# EAGLE schematic EncoderPCB_V1_0 (EAGLE 9.5.1)
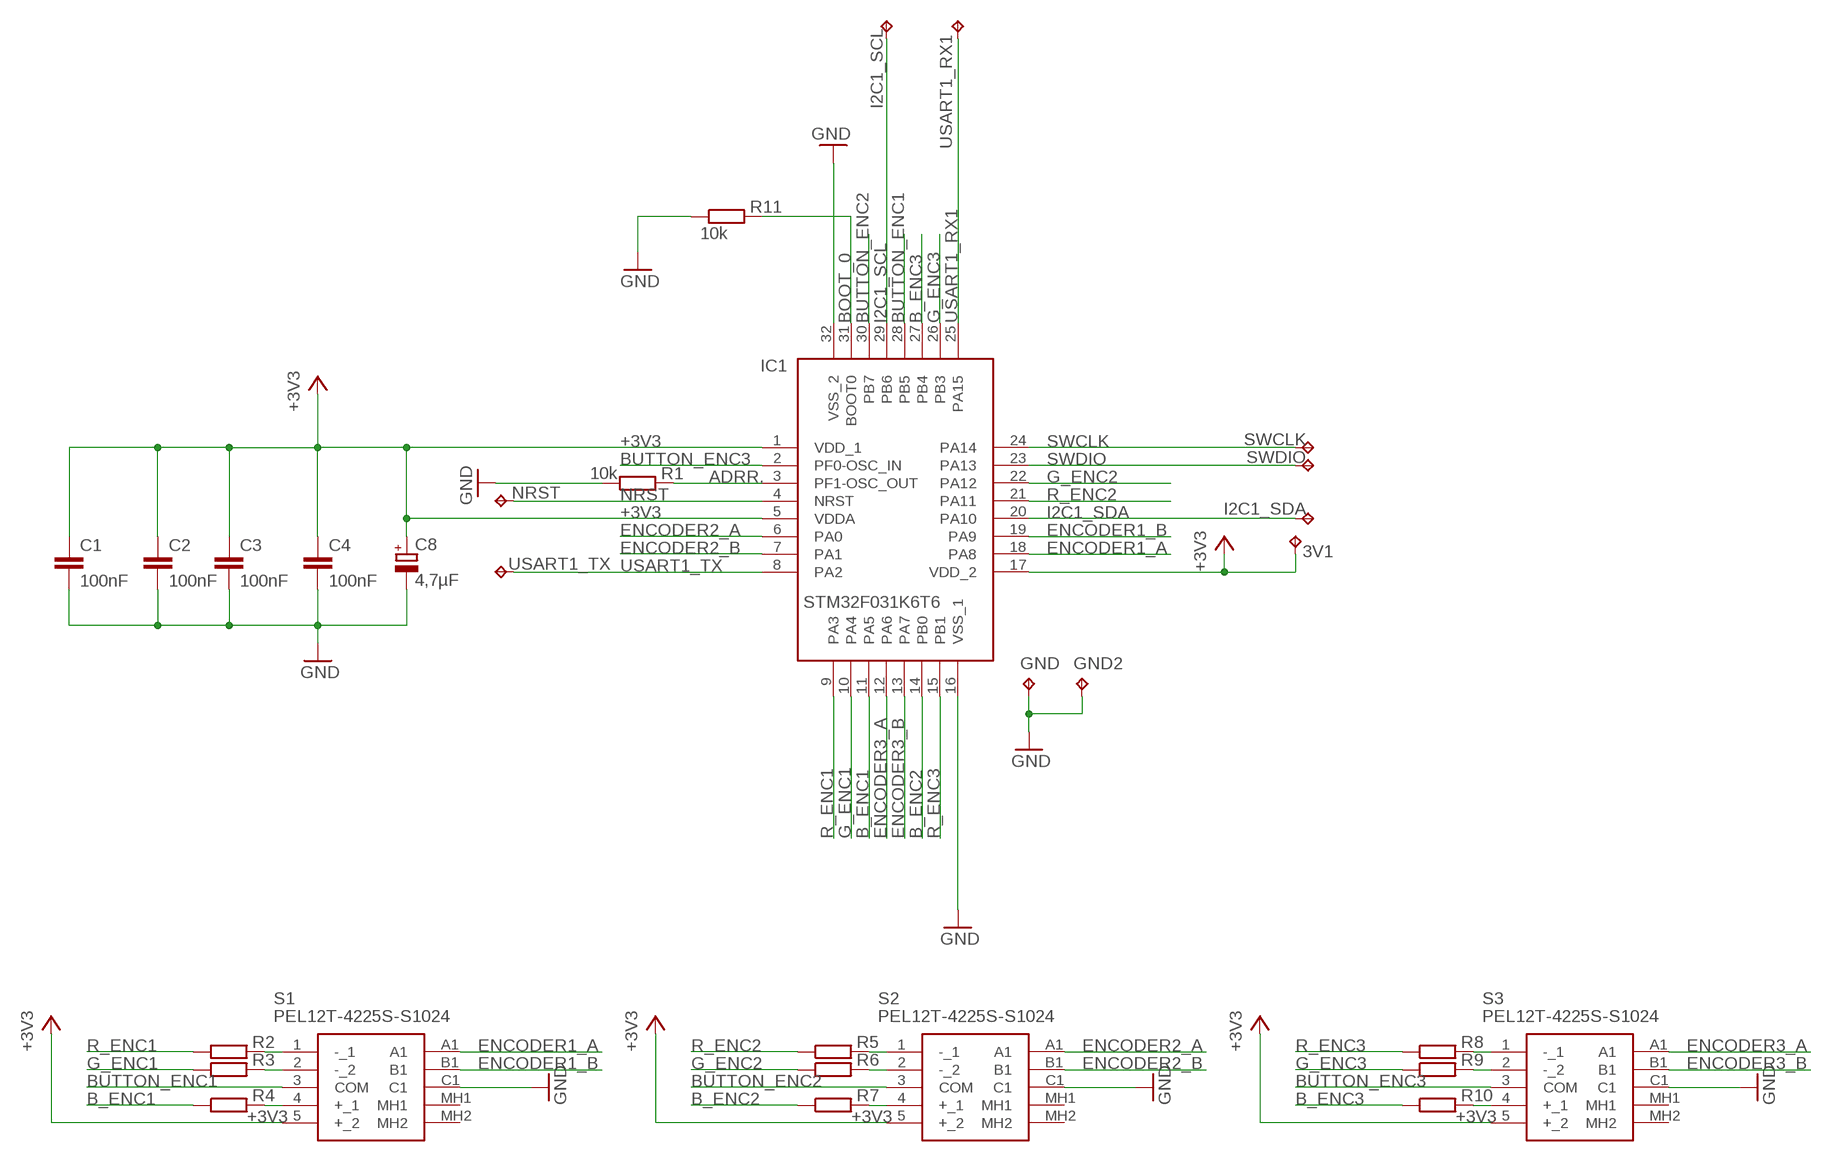
[diagram p0: schematic, sheet 1]

## Parts
3V1  TPTHT  [THT_PIN]
C1  100nF  CAPACITOR"  [C0603]
C2  100nF  CAPACITOR"  [C0603]
C3  100nF  CAPACITOR"  [C0603]
C4  100nF  CAPACITOR"  [C0603]
C8  4,7µF  SMD_ELCTROLYTIC  [153CLV-0605]
GND  TPTHT  [THT_PIN]
GND2  TPTHT  [THT_PIN]
I2C1_SCL  TPTHT  [THT_PIN]
I2C1_SDA  TPTHT  [THT_PIN]
IC1  STM32F031K6T6  [QFP80P900X900X160-32N]
NRST  TPTHT  [THT_PIN]
R1  10k  RESISTOR"  [R0805]
R2  RESISTOR"  [R0805]
R3  RESISTOR"  [R0805]
R4  RESISTOR"  [R0805]
R5  RESISTOR"  [R0805]
R6  RESISTOR"  [R0805]
R7  RESISTOR"  [R0805]
R8  RESISTOR"  [R0805]
R9  RESISTOR"  [R0805]
R10  RESISTOR"  [R0805]
R11  10k  RESISTOR"  [R0805]
S1  PEL12T-4225S-S1024  [PEL12T4225SS1024]
S2  PEL12T-4225S-S1024  [PEL12T4225SS1024]
S3  PEL12T-4225S-S1024  [PEL12T4225SS1024]
SWCLK  TPTHT  [THT_PIN]
SWDIO  TPTHT  [THT_PIN]
USART1_RX1  TPTHT  [THT_PIN]
USART1_TX  TPTHT  [THT_PIN]

## Nets
+3V3: 3V1.P$1(TP) C1.1 C2.1 C3.1 C4.1 C8.+ IC1.1(VDD_1) IC1.5(VDDA) IC1.17(VDD_2) S1.5(+_2) S2.5(+_2) S3.5(+_2)
ADRR.: IC1.3(PF1-OSC_OUT) R1.2
B_ENC1: IC1.11(PA5) R4.1
B_ENC2: IC1.14(PB0) R7.1
B_ENC3: IC1.27(PB4) R10.1
BOOT_0: IC1.31(BOOT0) R11.2
BUTTON_ENC1: IC1.28(PB5) S1.3(COM)
BUTTON_ENC2: IC1.30(PB7) S2.3(COM)
BUTTON_ENC3: IC1.2(PF0-OSC_IN) S3.3(COM)
ENCODER1_A: IC1.18(PA8) S1.A1
ENCODER1_B: IC1.19(PA9) S1.B1
ENCODER2_A: IC1.6(PA0) S2.A1
ENCODER2_B: IC1.7(PA1) S2.B1
ENCODER3_A: IC1.12(PA6) S3.A1
ENCODER3_B: IC1.13(PA7) S3.B1
G_ENC1: IC1.10(PA4) R3.1
G_ENC2: IC1.22(PA12) R6.1
G_ENC3: IC1.26(PB3) R9.1
GND: C1.2 C2.2 C3.2 C4.2 C8.- GND2.P$1(TP) GND.P$1(TP) IC1.16(VSS_1) IC1.32(VSS_2) R1.1 R11.1 S1.C1 S2.C1 S3.C1
I2C1_SCL: I2C1_SCL.P$1(TP) IC1.29(PB6)
I2C1_SDA: I2C1_SDA.P$1(TP) IC1.20(PA10)
N$9: R2.2 S1.1(-_1)
N$10: R3.2 S1.2(-_2)
N$11: R5.2 S2.1(-_1)
N$12: R4.2 S1.4(+_1)
N$13: R6.2 S2.2(-_2)
N$14: R7.2 S2.4(+_1)
N$15: R8.2 S3.1(-_1)
N$16: R9.2 S3.2(-_2)
N$17: R10.2 S3.4(+_1)
NRST: IC1.4(NRST) NRST.P$1(TP)
R_ENC1: IC1.9(PA3) R2.1
R_ENC2: IC1.21(PA11) R5.1
R_ENC3: IC1.15(PB1) R8.1
SWCLK: IC1.24(PA14) SWCLK.P$1(TP)
SWDIO: IC1.23(PA13) SWDIO.P$1(TP)
USART1_RX1: IC1.25(PA15) USART1_RX1.P$1(TP)
USART1_TX: IC1.8(PA2) USART1_TX.P$1(TP)
Unconnected: S1.MH1 S1.MH2 S2.MH1 S2.MH2 S3.MH1 S3.MH2

## Library data of the parts
3V1 GND GND2 I2C1_SCL I2C1_SDA NRST SWCLK SWDIO USART1_RX1 USART1_TX = C_Sager_Bibliothek:TP
C1-C4 = C_Sager_Bibliothek:CAPACITOR: capacitor
C8 = C_Sager_Bibliothek:SMD_ELCTROLYTIC: SMD Elektrolyt Kondensator 153CLV-0605
IC1 = C_Sager_Bibliothek:STM32F031K6T6: ARM Microcontrollers - MCU 16/32-BITS MICROS Source: Datasheet <https://componentsearchengine.com/Datasheets/1/STM32F031K6T6.pdf>; DESCRIPTION: ARM Microcontrollers - MCU 16/32-BITS MICROS; HEIGHT: 1.6mm; MANUFACTURER_NAME: STMicroelectronics; MANUFACTURER_PART_NUMBER: STM32F031K6T6; MOUSER_PART_NUMBER: 511-STM32F031K6T6; MOUSER_PRICE-STOCK: https://www.mouser.com/Search/Refine.aspx?Keyword=511-STM32F031K6T6
R1-R11 = C_Sager_Bibliothek:RESISTOR: +/- 5 % resistor
S1-S3 = C_Sager_Bibliothek:PEL12T-4225S-S1024: Encoders Red Blue/Green LED Push Switch Knurled Source: Datasheet <https://componentsearchengine.com/Datasheets/1/PEL12T-4225S-S1024.pdf>; DESCRIPTION: Encoders Red Blue/Green LED Push Switch Knurled; HEIGHT: 25mm; MANUFACTURER_NAME: Bourns; MANUFACTURER_PART_NUMBER: PEL12T-4225S-S1024; MOUSER_PART_NUMBER: 652-PEL12T4225SS1024; MOUSER_PRICE-STOCK: https://www.mouser.com/Search/Refine.aspx?Keyword=652-PEL12T4225SS1024